# Altium schematic sheet main-board-SCHEMATIC.schdoc
size 134 x 199 mm
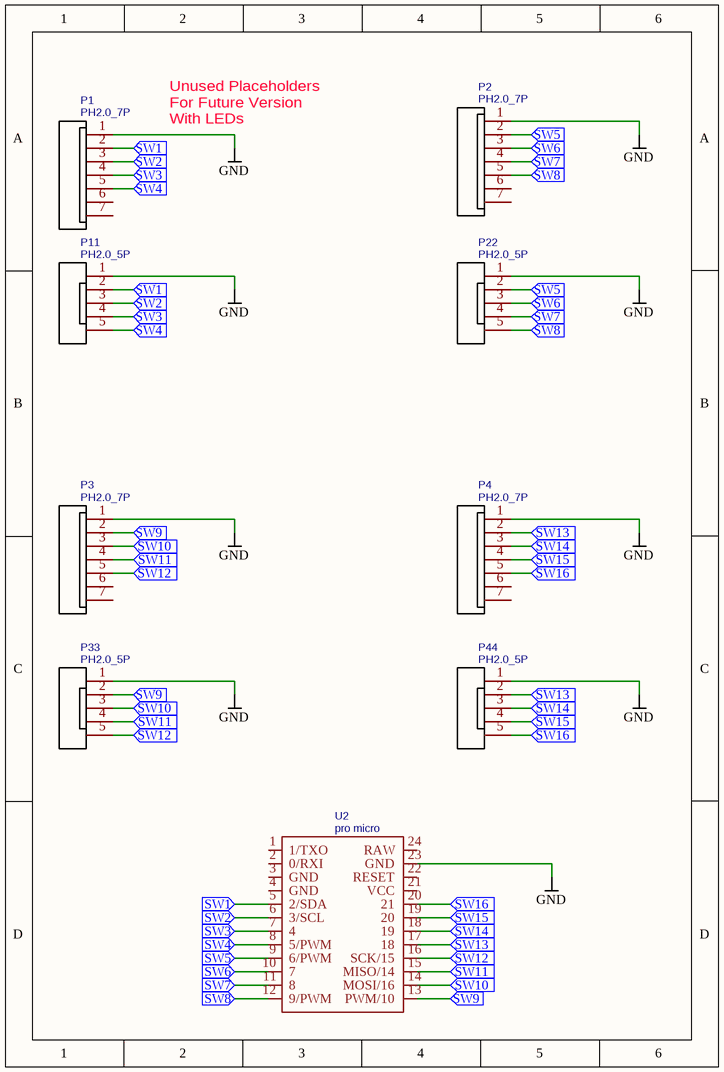
[diagram p0: main-board-SCHEMATIC.schdoc]

## Parts
P1  PH2.0_7P  [PH2.0-7P-90-DIP]
P2  PH2.0_7P  [PH2.0-7P-90-DIP]
P3  PH2.0_7P  [PH2.0-7P-90-DIP]
P4  PH2.0_7P  [PH2.0-7P-90-DIP]
P11  PH2.0_5P  [PH2.0_5P]
P22  PH2.0_5P  [PH2.0_5P]
P33  PH2.0_5P  [PH2.0_5P]
P44  PH2.0_5P  [PH2.0_5P]
U2  pro micro  [PRO MICRO]

## Ports
SW1 (in), SW2 (in), SW3 (in), SW4 (in), SW5 (in), SW6 (in), SW7 (in), SW8 (in), SW9 (in), SW10 (in), SW11 (in), SW12 (in), SW13 (in), SW14 (in), SW15 (in), SW16 (in)

## Nets
GND: P1.1 P2.1 P3.1 P4.1 P11.1 P22.1 P33.1 P44.1 U2.23(GND)
SW1: P1.2 P11.2 U2.5(2/SDA) ; port SW1
SW2: P1.3 P11.3 U2.6(3/SCL) ; port SW2
SW3: P1.4 P11.4 U2.7(4) ; port SW3
SW4: P1.5 P11.5 U2.8(5/PWM) ; port SW4
SW5: P2.2 P22.2 U2.9(6/PWM) ; port SW5
SW6: P2.3 P22.3 U2.10(7) ; port SW6
SW7: P2.4 P22.4 U2.11(8) ; port SW7
SW8: P2.5 P22.5 U2.12(9/PWM) ; port SW8
SW9: P3.2 P33.2 U2.13(PWM/10) ; port SW9
SW10: P3.3 P33.3 U2.14(MOSI/16) ; port SW10
SW11: P3.4 P33.4 U2.15(MISO/14) ; port SW11
SW12: P3.5 P33.5 U2.16(SCK/15) ; port SW12
SW13: P4.2 P44.2 U2.17(18) ; port SW13
SW14: P4.3 P44.3 U2.18(19) ; port SW14
SW15: P4.4 P44.4 U2.19(20) ; port SW15
SW16: P4.5 P44.5 U2.20(21) ; port SW16

Not connected (* = marked no-connect by the designer): P1 6 7; P2 6 7; P3 6 7; P4 6 7; U2 1(1/TXO) 2(0/RXI) 3(GND) 4(GND) 21(VCC) 22(RESET) 24(RAW)

## Notes on the sheet
- Unused Placeholders
  For Future Version
  With LEDs

## Library data of the parts
P1-P4 = PH2.0_7P: Manufacturer Part: New SchematicLib; Contributor: robellado; Package Display: No; spicePre: P; spiceSymbolName: PH2.0_7P
P11 P22 P33 P44 = PH2.0_5P: Manufacturer Part: New SchematicLib; Contributor: oleg.evsegneev; spicePre: P; spiceSymbolName: PH2.0_5P
U2 = pro micro: Contributor: Chris Cullin; spicePre: U; spiceSymbolName: pro micro